# EAGLE design ArduinoBoardPOE (EAGLE 7.4.0)
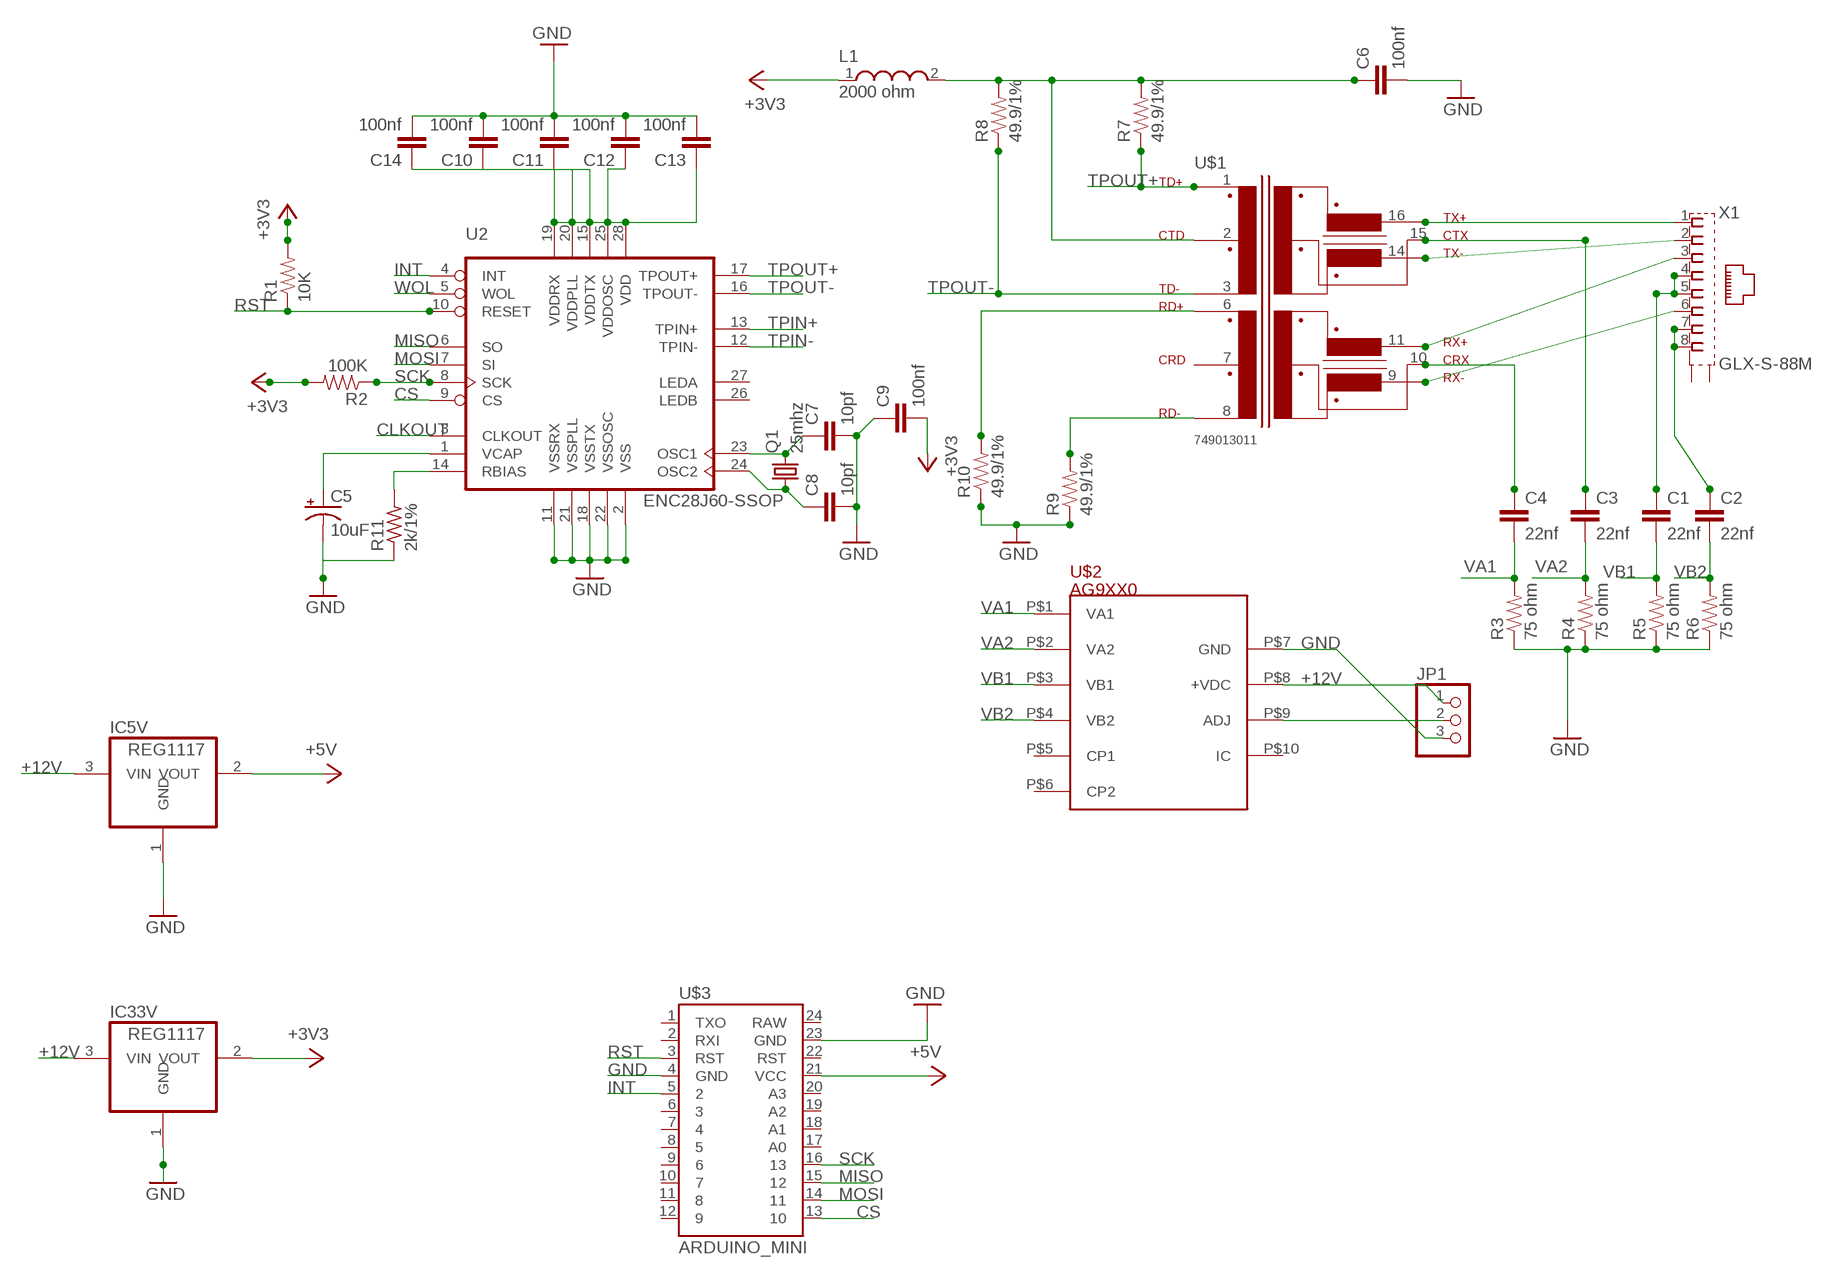
[diagram p0: schematic, sheet 1]

## Parts
C1  22nf  CAP0805  [0805]
C2  22nf  CAP0805  [0805]
C3  22nf  CAP0805  [0805]
C4  22nf  CAP0805  [0805]
C5  10uF  10UF-16V-10%(TANT)  [EIA3216]
C6  100nf  CAP0805  [0805]
C7  10pf  CAP0805  [0805]
C8  10pf  CAP0805  [0805]
C9  100nf  CAP0805  [0805]
C10  100nf  CAP0805  [0805]
C11  100nf  CAP0805  [0805]
C12  100nf  CAP0805  [0805]
C13  100nf  CAP0805  [0805]
C14  100nf  CAP0805  [0805]
IC5V  REG1117  [SOT223]
IC33V  REG1117  [SOT223]
JP1  PINHD-1X3  [1X03]
L1  2000 ohm  WE-CBA_0805(WB/HS)  [WE-CBA_0805(W=3)]
Q1  25mhz  CRYSTALHC49UP  [HC49UP]
R1  10K  RESISTOR0805-RES  [0805]
R2  100K  RESISTOR0805-RES  [0805]
R3  75 ohm  RESISTOR0805-RES  [0805]
R4  75 ohm  RESISTOR0805-RES  [0805]
R5  75 ohm  RESISTOR0805-RES  [0805]
R6  75 ohm  RESISTOR0805-RES  [0805]
R7  49.9/1%  RESISTOR0805-RES  [0805]
R8  49.9/1%  RESISTOR0805-RES  [0805]
R9  49.9/1%  RESISTOR0805-RES  [0805]
R10  49.9/1%  RESISTOR0805-RES  [0805]
R11  2k/1%  R-US_R0805  [R0805]
U2  ENC28J60-SSOP  [SSOP28]
U$1  749013011  [749013011]
U$2  AG9XX0  [AG9000]
U$3  ARDUINO_MINI  [ARDUINO_MINI]
X1  GLX-S-88M  [GLX-S-88M]

## Nets
+3V3: C9.2 IC33V.2(VOUT) L1.1 R1.2 R2.2
+5V: IC5V.2(VOUT) U$3.21(VCC)
+12V: IC5V.3(VIN) IC33V.3(VIN) JP1.1 U$2.P$8(+VDC)
CLKOUT: U2.3(CLKOUT)
CS: U2.9(CS) U$3.13
GND: C5.C(-) C6.2 C7.2 C8.2 C9.1 C10.2 C11.2 C12.2 C13.2 C14.2 IC5V.1(GND) IC33V.1(GND) JP1.3 R3.1 R4.1 R5.1 R6.1 R9.1 R10.1 R11.1 U2.2(VSS) U2.11(VSSRX) U2.18(VSSTX) U2.21(VSSPLL) U2.22(VSSOSC) U$2.P$7(GND) U$3.4(GND) U$3.23(GND)
INT: U2.4(INT) U$3.5
MISO: U2.6(SO) U$3.15
MOSI: U2.7(SI) U$3.14
N$1: U$1.16 X1.1
N$2: U$1.14 X1.2
N$3: U$1.11 X1.3
N$4: U$1.9 X1.6
N$5: C2.1 X1.7 X1.8
N$6: C1.1 X1.4 X1.5
N$7: C3.1 U$1.15
N$8: C4.1 U$1.10
N$9: C6.1 L1.2 R7.2 R8.2 U$1.2
N$10: C7.1 Q1.2 U2.23(OSC1)
N$11: JP1.2 U$2.P$9(ADJ)
N$13: C8.1 Q1.1 U2.24(OSC2)
N$14: C10.1 C11.1 C12.1 C13.1 C14.1 U2.15(VDDTX) U2.19(VDDRX) U2.20(VDDPLL) U2.25(VDDOSC) U2.28(VDD)
N$16: C5.A(+) U2.1(VCAP)
N$17: R11.2 U2.14(RBIAS)
RST: R1.1 U2.10(RESET) U$3.3(RST)
SCK: R2.1 U2.8(SCK) U$3.16
TPIN+: R10.2 U2.13(TPIN+) U$1.6
TPIN-: R9.2 U2.12(TPIN-) U$1.8
TPOUT+: R7.1 U2.17(TPOUT+) U$1.1
TPOUT-: R8.1 U2.16(TPOUT-) U$1.3
VA1: C4.2 R3.2 U$2.P$1(VA1)
VA2: C3.2 R4.2 U$2.P$2(VA2)
VB1: C1.2 R5.2 U$2.P$3(VB1)
VB2: C2.2 R6.2 U$2.P$4(VB2)
WOL: U2.5(WOL)
Unconnected: U2.26(LEDB) U2.27(LEDA) U$1.7 U$2.P$5(CP1) U$2.P$6(CP2) U$2.P$10(IC) U$3.1(TXO) U$3.2(RXI) U$3.6 U$3.7 U$3.8 U$3.9 U$3.10 U$3.11 U$3.12 U$3.17(A0) U$3.18(A1) U$3.19(A2) U$3.20(A3) U$3.22(RST) U$3.24(RAW) X1.S1 X1.S2

## Library data of the parts
C1-C4 C6-C14 = SparkFun-Capacitors:CAP: Capacitor Standard 0603 ceramic capacitor, and 0.1" leaded capacitor.
C5 = SparkFun-Capacitors:10UF-16V-10%(TANT): CAP-00811 1206/EIA-3216 Tantalum capacitor; PROD_ID: CAP-00811
IC5V IC33V = burr-brown:REG1117: 800mA and 1A Low Dropout (LDO) Positive Regulator 1.8V, 2.5V, 2.85V, 3.3V, 5V, and Adj; MPN: REG1117; OC_FARNELL: 1097566; OC_NEWARK: 14P6981
JP1 = Adafruit:PINHD-1X3: PIN HEADER
L1 = SignalCommunications:WE-CBA: WE-CBA SMD EMI Suppression Ferrite Bead Characteristics Reliable Ni-Sn electrodes High rated current up to 5A Recommended soldering: Reflow Operating temperature: -55°C to +125°C Applications * Perfect as data line filter and for uncoupling of distribution voltage *This special SMD chip bead ferrites can be put directly on the printed circuit board. They offer excellent anti-EMI properties and low DC-resistance. Placed very close next to the interference source even with smallest size 0402,maximal impedance at 1000 Ω can be reached. *High Speed: "High Speed " SMD ferrites WE-CBF have lower impedance in the lower frequency ranges thus they have only a low attenuation for fast signals. Application e.g. USB 2.0, IEEE 1394,LVDS *Wide Band: "Wide Band" SMD ferrites WE-CBF already show high impedance in low frequency range. Therefore they are wide band through the whole spectrum. Application e.g. control signats, RS232, RS422, DC/DC converter *High Current: "High Current " SMD ferrites WE-CBF are designed for high current (over 1 A). The rated current refers to 40K self-heating. High current SMD ferrites are available in all there types (High Speed, Wide Band and High Frequency). Application e.g. power supply, DC/DC converter *Advice: Pay attention for the use of SMD-Ferrites for high current>1A and ambient temperature over +85°C that the rated current has to be reduced when temperature is above +85°C (Derating). *At+100°C environment temperature the maximal rated current has to add up to only 60% of the data sheet value ,without an overload of the component. Variant abbreviation WB means WIDE BAND HS means HIGH SPEED HC means HIGH CURRENT <http://katalog.we-online.de/media/images/eisos/FeCBA_pf2.jpg> Details see: http://katalog.we-online.de/en/pbs/WE-CBA/ Created: 2015-02-02 2015 (C) Wurth Elektronik
Q1 = Adafruit:CRYSTAL: CRYSTAL; OC_FARNELL: unknown; OC_NEWARK: unknown
R1-R10 = SparkFun-Resistors:RESISTOR: Resistor Basic schematic elements and footprints for 0603, 1206, and PTH resistors.
R11 = Adafruit:R-US_: RESISTOR, American symbol
U2 = microchip-enc28j60:ENC28J60-*: Microchip 10Mbit Eth. contoller with SPI interface
U$1 = Wurth_Electronics_Midcom_Speedy_and_standard_magnetics:749013011: Package Style: 10/100, 1 Port, ETR, PoE Mounting: SMD Pins: 16 pins Header: 250-0512 Best pinouts for production vary per application. Please contact Wurth Electronics Midcom, Inc. for assistance with your custom design. Datasheet: 749013011 <http://katalog.we-online.de/kataloge/eisos/media/pdf/749013011.pdf> Website: Wurth Electronics Midcom <http://www.we-online.com/midcom> Contact us Wurth Electronics Midcom, Inc. 121 Airport Dr. Watertown, SD 57201 Phone: (605) 886-4385 Fax: (605) 886-4486 E-Mail: midcom@we-online.com
U$2 = SmartPrj:AG9XX0: PoE module
U$3 = SparkFun-Boards:ARDUINO_MINI: Arduino Pro Mini footprint
X1 = con-kycon:GLX-S-88M: Mod. Jack, Right Angle, 8 posiotion, 8 contatcs RJ45 Source: GLX-S-88M.pdf; OC_FARNELL: unknown; OC_NEWARK: unknown

## Board
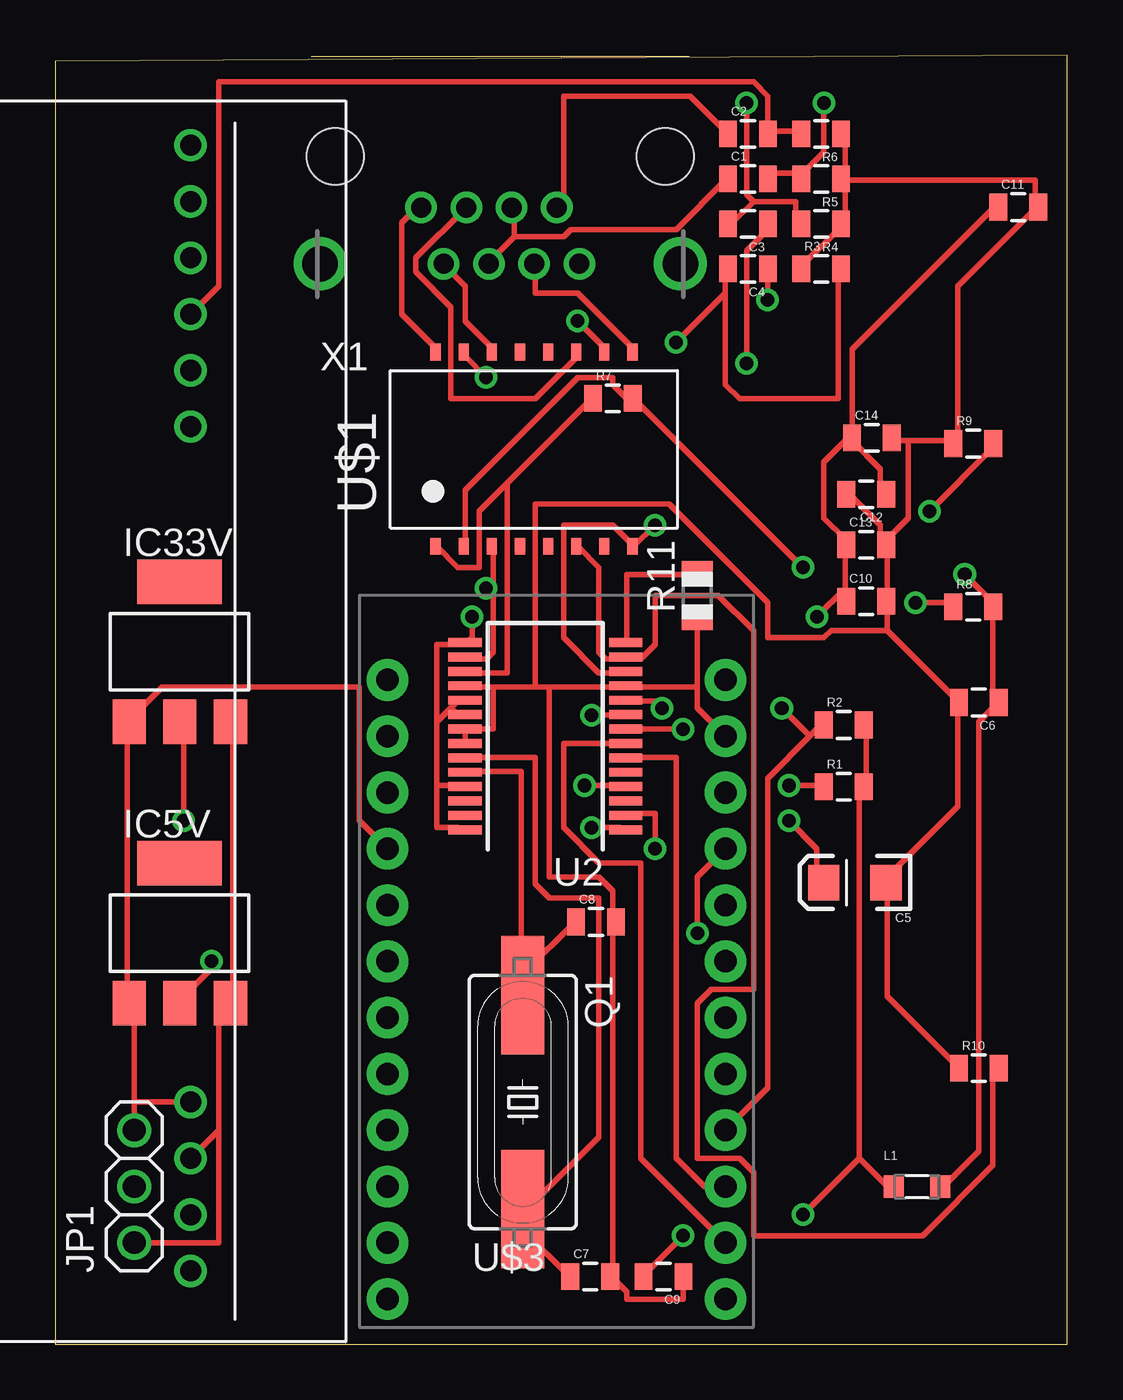
[diagram p1: board, top side]
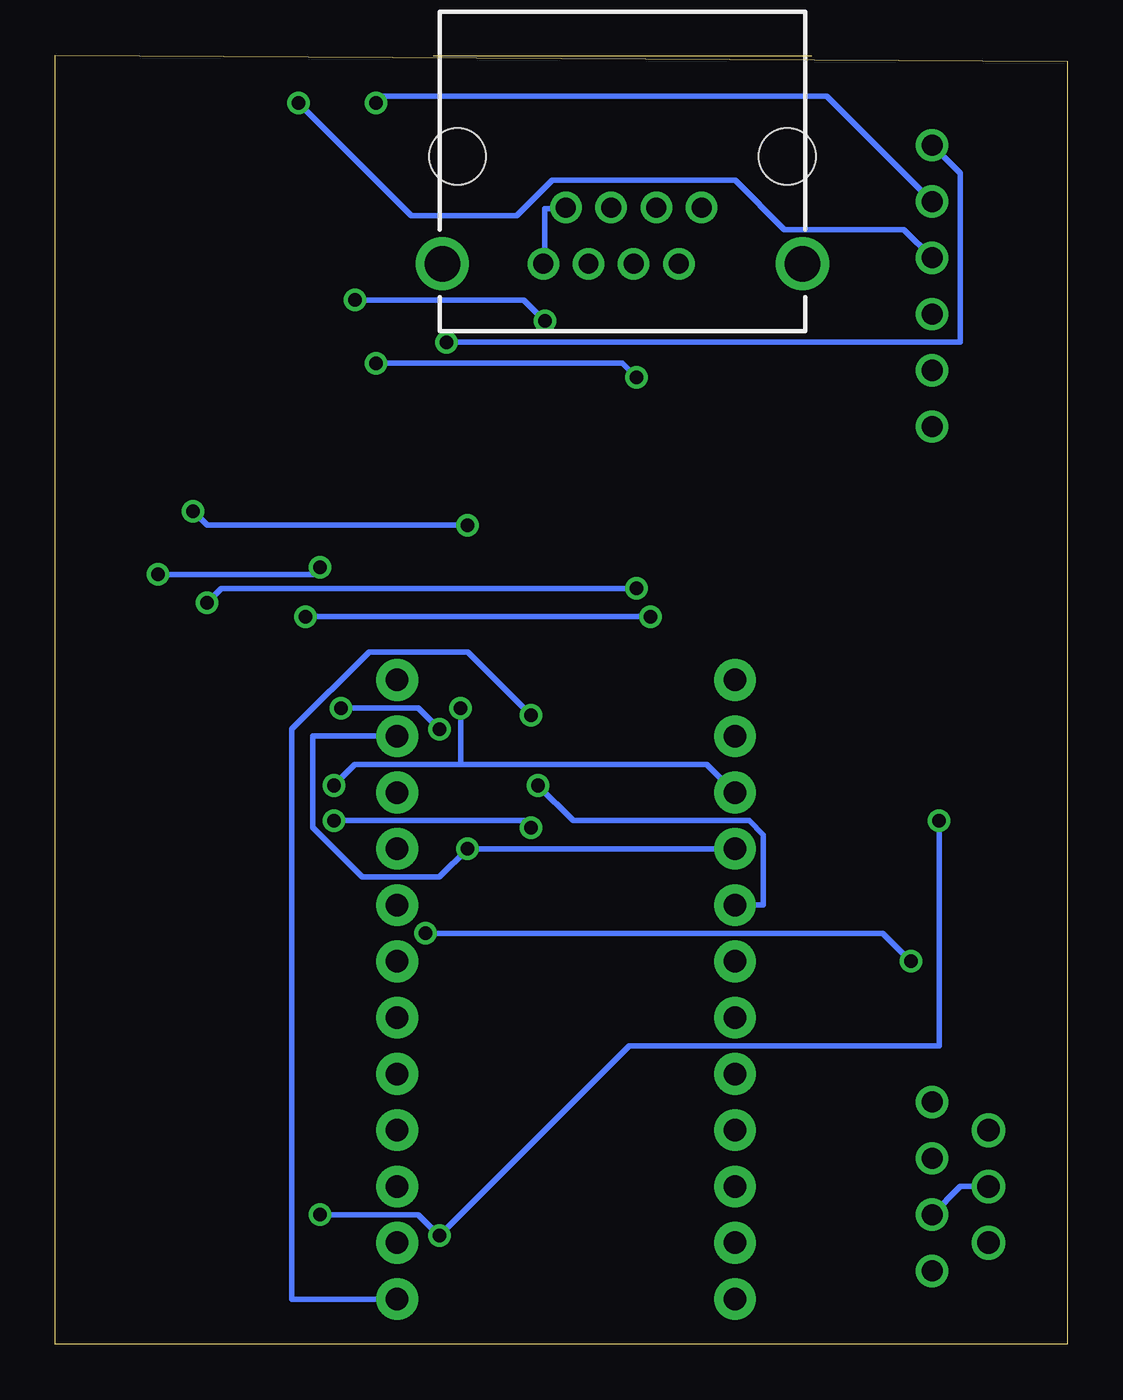
[diagram p2: board, bottom side, seen from below]

Size 45.64 x 58.16 mm. Coordinates in mm from the lower left corner, seen from the top.
Outline: 0,0 45.64,0 45.64,58.16 0,57.9 0,0
Copper layers (1*16): Top 0.035mm / dielectric 1.5mm / Bottom 0.035mm
Design rules "default": minimum track width 10mil, minimum drill 24mil, track to track 8mil, track to pad 8mil, pad to pad 8mil, via to via 8mil, smd to smd 8mil, copper to edge 40mil, drill to drill 8mil, minimum pad ring 10mil, minimum via ring 8mil, stop-mask expansion 4mil, vias tented up to drill 0mil, thermal gap 10mil

### Footprints (pad centres in the part's own frame; a part is rotated, then mirrored left to right if it is on the bottom)
0805 = smd 0.8 x 1.2: 1 -0.9,0; 2 0.9,0
EIA3216 = smd 1.4 x 1.6: A 1.4,0; C -1.4,0
SOT223 = smd 1.499 x 2.007: 1 -2.261,-3.15; 2 0.025,-3.15; 3 2.311,-3.15 | smd 3.81 x 2.007: 4 0,3.15
1X03 = drill 1.016: 1 -2.54,0; 2 0,0; 3 2.54,0
WE-CBA_0805(W=3) = smd 0.9 x 1: 1 -1.05,0; 2 1.05,0
HC49UP = smd 5.334 x 1.93: 1 -4.826,0; 2 4.826,0
R0805 = smd 1.1 x 1.4: 1 -1,0; 2 1,0
SSOP28 = smd 0.4 x 1.5: 1 -4.225,-3.625; 2 -3.575,-3.625; 3 -2.925,-3.625; 4 -2.275,-3.625; 5 -1.625,-3.625; 6 -0.975,-3.625; 7 -0.325,-3.625; 8 0.325,-3.625; 9 0.975,-3.625; 10 1.625,-3.625; 11 2.275,-3.625; 12 2.925,-3.625; 13 3.575,-3.625; 14 4.225,-3.625; 15 4.225,3.625; 16 3.575,3.625; 17 2.925,3.625; 18 2.275,3.625; 19 1.625,3.625; 20 0.975,3.625; 21 0.325,3.625; 22 -0.325,3.625; 23 -0.975,3.625; 24 -1.625,3.625; 25 -2.275,3.625; 26 -2.925,3.625; 27 -3.575,3.625; 28 -4.225,3.625
749013011 = smd 0.762 x 0.457: 1 -4.381,4.445; 2 -4.381,3.175; 3 -4.381,1.905; 4 -4.381,0.635; 5 -4.381,-0.635; 6 -4.381,-1.905; 7 -4.381,-3.175; 8 -4.381,-4.445; 9 4.381,-4.445; 10 4.381,-3.175; 11 4.381,-1.905; 12 4.381,-0.635; 13 4.381,0.635; 14 4.381,1.905; 15 4.381,3.175; 16 4.381,4.445
AG9000 = drill 0.95 pad 1.422: P$1 0,0; P$2 2.54,0; P$3 5.08,0; P$4 7.62,0; P$5 10.16,0; P$6 12.7,0; P$7 43.18,0; P$8 45.72,0; P$9 48.26,0; P$10 50.8,0
ARDUINO_MINI = drill 1.016 pad 1.88: 1 -7.62,12.7; 2 -7.62,10.16; 3 -7.62,7.62; 4 -7.62,5.08; 5 -7.62,2.54; 6 -7.62,0; 7 -7.62,-2.54; 8 -7.62,-5.08; 9 -7.62,-7.62; 10 -7.62,-10.16; 11 -7.62,-12.7; 12 -7.62,-15.24; 13 7.62,-15.24; 14 7.62,-12.7; 15 7.62,-10.16; 16 7.62,-7.62; 17 7.62,-5.08; 18 7.62,-2.54; 19 7.62,0; 20 7.62,2.54; 21 7.62,5.08; 22 7.62,7.62; 23 7.62,10.16; 24 7.62,12.7
GLX-S-88M = drill 0.9 pad 1.422: 1 -3.57,-2.3; 2 -2.55,-4.84; 3 -1.53,-2.3; 4 -0.51,-4.84; 5 0.51,-2.3; 6 1.53,-4.84; 7 2.55,-2.3; 8 3.57,-4.84 | drill 1.6 pad 2.184: S1 -8.125,-4.84; S2 8.125,-4.84 | hole 2.55: -7.44,0; 7.44,0

### Placement (x,y rotation side)
C1  31.24,52.58 0 top
C2  31.24,54.61 0 top
C3  31.24,50.55 180 top
C4  31.24,48.51 180 top
C5  36.07,20.83 180 top
C6  41.66,28.96 180 top
C7  24.13,3.05 0 top
C8  24.38,19.05 0 top
C9  27.43,3.05 180 top
C10  36.58,33.53 0 top
C11  43.43,51.31 0 top
C12  36.58,38.35 180 top
C13  36.58,36.07 0 top
C14  36.83,40.89 0 top
IC5V  5.59,18.54 0 top
IC33V  5.59,31.24 0 top
JP1  3.56,7.11 90 top
L1  38.86,7.11 0 top
Q1  21.08,10.92 270 top
R1  35.56,25.15 0 top
R2  35.56,27.94 0 top
R3  34.54,48.51 0 top
R4  34.54,50.55 180 top
R5  34.54,52.58 180 top
R6  34.54,54.61 180 top
R7  25.15,42.67 0 top
R8  41.4,33.27 0 top
R9  41.4,40.64 0 top
R10  41.66,12.45 0 top
R11  28.96,33.78 90 top
U2  22.1,27.43 90 top
U$1  21.59,40.39 90 top
U$2  6.1,54.1 270 top
U$3  22.61,17.27 0 top
X1  20.07,53.59 0 top

### Tracks (layer width: path | path; a pad name or v marks a point on that pad's centre or on a via)
+3V3  (via drill 0.61)
  Top 0.254: 36.26,8.38 37.53,7.11 L1.1 | 36.26,8.38 36.26,24.89 R1.2 36.58,25.21 36.58,27.75 R2.2 | v28.32,4.89 26.73,3.3 C9.2 | 36.26,8.38 v33.72,5.84 | v5.78,23.62 5.78,28.07 IC33V.2
  Bottom 0.254: v33.72,5.84 29.27,5.84 v28.32,4.89 19.75,13.46 5.78,13.46 v5.78,23.62
+5V  (via drill 0.61)
  Top 0.254: v7.05,17.27 7.05,16.95 5.78,15.68 IC5V.2 | v28.96,18.54 28.96,21.08 U$3.21
  Bottom 0.254: v7.05,17.27 8.32,18.54 v28.96,18.54
+12V
  Top 0.254: 7.37,9.65 7.37,15.05 7.68,15.37 IC5V.3 8,15.68 8,28.07 IC33V.3 | U$2.P$8 7.37,9.65 | JP1.1 7.37,4.57 7.37,9.65
CS  (via drill 0.61)
  Top 0.254: v24.19,28.38 25.46,28.38 U2.9
  Bottom 0.254: v24.19,28.38 27.05,31.24 31.5,31.24 34.99,27.75 34.99,2.03 U$3.13
GND  (via drill 0.61)
  Top 0.254: R6.1 35.62,54.42 35.62,52.83 R5.1 35.62,52.51 | R3.1 33.72,48.7 35.31,50.29 R4.1 35.62,50.61 35.62,52.51 | 38.48,40.77 37.85,40.77 C14.2 | 38.48,40.77 40.39,40.77 R9.1 40.7,40.77 40.7,47.75 44.2,51.24 C11.2 44.2,51.56 44.2,52.51 35.62,52.51 | R10.1 40.7,12.51 37.53,15.68 37.53,20.77 C5.C 37.53,21.08 40.7,24.26 40.7,28.7 C6.2 40.7,29.02 37.53,32.2 | C13.2 37.53,36 37.53,33.78 C10.2 37.53,33.47 37.53,32.2 | C12.2 35.94,38.23 37.21,36.96 37.21,36.32 C13.2 | 38.48,40.77 38.48,37.27 37.53,36.32 C13.2 | JP1.3 3.56,10.92 | 3.56,10.92 3.56,15.37 IC5V.1 3.24,15.68 3.24,28.07 IC33V.1 3.56,28.38 4.83,29.65 13.72,29.65 13.72,23.62 U$3.4 | 3.56,10.92 U$2.P$7 | C9.1 28.32,2.98 28.32,2.03 25.78,2.03 25.78,2.35 25.15,2.98 C7.2 25.15,3.3 25.15,18.86 C8.2 25.15,19.18 25.15,20.45 24.51,21.08 22.29,21.08 22.29,29.65 | v27.05,22.35 27.05,23.94 25.78,23.94 U2.2 | 18.48,27.75 U2.22 | 22.29,29.65 25.46,29.65 U2.11 25.78,29.65 28.96,29.65 | 22.29,29.65 21.65,29.65 | 21.65,29.65 19.75,29.65 | 19.75,29.65 18.48,29.65 U2.18 | 18.48,27.75 19.75,27.75 19.75,29.65 | 18.48,27.75 U2.21 | 28.96,29.65 28.96,28.7 U$3.23 | 28.96,29.65 R11.1 | 37.53,32.2 34.99,32.2 34.67,31.88 32.13,31.88 32.13,33.47 27.69,37.91 21.65,37.91 21.65,29.65
  Bottom 0.254: U$3.4 v27.05,22.35 28.32,21.08 31.81,21.08 34.04,23.3 34.04,27.43 U$3.23
INT  (via drill 0.61)
  Top 0.254: v23.88,25.21 25.46,25.21 U2.4
  Bottom 0.254: v23.88,25.21 22.29,23.62 14.35,23.62 13.72,22.99 13.72,19.81 U$3.5
MISO
  Top 0.254: U$3.15 29.27,7.11 28,8.38 28,26.48 25.78,26.48 U2.6
MOSI
  Top 0.254: U$3.14 26.42,8.38 26.42,21.72 24.51,21.72 22.92,23.3 22.92,27.11 25.46,27.11 U2.7
N$1
  Top 0.254: U$1.16 17.21,44.9 15.62,46.48 15.62,50.61 16.26,51.24 X1.1
N$2
  Top 0.254: U$1.14 19.75,44.9 18.48,46.16 18.48,47.75 17.53,48.7 X1.2
N$3
  Top 0.254: U$1.11 23.56,44.58 21.65,42.67 17.84,42.67 17.84,46.8 16.26,48.39 16.26,49.02 18.48,51.24 X1.3
N$4
  Top 0.254: U$1.9 26.1,44.9 23.56,47.43 21.65,47.43 21.65,48.7 X1.6
N$5
  Top 0.254: C2.1 30.23,54.74 28.64,56.32 22.92,56.32 22.92,51.56 X1.7
  Bottom 0.254: X1.8 23.56,49.02 23.56,51.24 22.92,51.24 X1.7
N$6
  Top 0.254: 20.7,49.97 22.92,49.97 23.24,50.29 28,50.29 30.23,52.51 C1.1 | 20.7,49.97 20.7,51.24 X1.5 | 20.7,49.97 19.75,49.02 X1.4
N$7  (via drill 0.61)
  Top 0.254: v19.43,43.62 18.48,44.58 U$1.15 | v31.18,44.26 31.18,49.34 32.13,50.29 C3.1
  Bottom 0.254: v19.43,43.62 20.07,44.26 v31.18,44.26
N$8  (via drill 0.61)
  Top 0.254: v23.56,46.16 24.83,44.9 U$1.10 | v32.13,47.12 32.13,48.39 C4.1
  Bottom 0.254: v23.56,46.16 24.51,47.12 v32.13,47.12
N$9  (via drill 0.61)
  Top 0.254: U$1.2 18.48,36 18.48,38.54 23.56,43.62 25.15,43.62 25.15,43.31 25.78,42.67 R7.2 26.1,42.67 v33.72,35.05 | L1.2 40.07,7.11 41.66,8.7 41.66,28.07 42.29,28.7 C6.1 42.29,29.02 42.29,33.15 R8.2 42.29,33.47 v41.02,34.73
  Bottom 0.254: v33.72,35.05 34.04,34.73 v41.02,34.73
N$10
  Top 0.254: C7.1 22.92,3.3 21.34,4.89 21.34,5.84 Q1.2 21.34,6.16 24.51,9.33 24.51,20.13 22.29,20.13 21.65,20.77 21.65,26.48 18.48,26.48 U2.23
N$11
  Bottom 0.254: U$2.P$9 4.83,7.11 JP1.2
N$13
  Top 0.254: C8.1 23.24,18.86 21.34,16.95 21.34,16 Q1.1 21.02,16 21.02,25.84 18.48,25.84 U2.24
N$14  (via drill 0.61)
  Top 0.254: 17.21,28.07 17.21,25.21 | 17.21,25.21 17.21,23.3 18.16,23.3 U2.28 | 17.84,28.7 18.16,29.02 U2.19 | 17.84,28.7 17.21,28.07 | 17.21,25.21 18.16,25.21 U2.25 | 17.84,28.7 18.16,28.38 U2.20 | 17.21,28.07 17.21,31.56 18.16,31.56 U2.15 18.48,31.56 18.8,31.88 v18.8,32.83 | 35.62,34.1 35.62,36 C13.1 35.62,36.32 34.67,37.27 34.67,39.81 35.62,40.77 C14.1 | 35.62,34.1 35.62,33.78 C10.1 35.62,34.1 | C14.1 35.94,40.77 37.21,39.5 37.21,38.54 C12.1 | C11.1 42.29,51.24 35.94,44.9 35.94,41.08 C14.1 | 35.62,34.1 v34.35,32.83
  Bottom 0.254: v34.35,32.83 v18.8,32.83
N$16  (via drill 0.61)
  Top 0.254: v24.19,23.3 25.46,23.3 U2.1 | v33.08,23.62 34.35,22.35 34.35,21.08 C5.A
  Bottom 0.254: v24.19,23.3 24.51,23.62 v33.08,23.62
N$17
  Top 0.254: R11.2 28.96,34.73 25.78,34.73 25.78,31.56 U2.14
RST  (via drill 0.61)
  Top 0.254: v33.08,25.21 34.35,25.21 R1.1 | v27.37,28.7 27.37,29.02 25.78,29.02 U2.10
  Bottom 0.254: v33.08,25.21 32.13,26.16 27.37,26.16 | 27.37,26.16 16.26,26.16 U$3.3 | 27.37,26.16 v27.37,28.7
SCK  (via drill 0.61)
  Top 0.254: 34.04,27.43 32.13,25.53 32.13,11.56 U$3.16 | 34.04,27.43 34.35,27.75 R2.1 | v28.32,27.75 25.78,27.75 U2.8 | 34.04,27.43 v32.77,28.7
  Bottom 0.254: v28.32,27.75 29.27,28.7 v32.77,28.7
TPIN+
  Top 0.254: U$1.6 23.56,36 24.51,35.05 24.51,31.24 24.83,30.93 25.46,30.93 U2.13 25.78,30.93 26.42,30.93 27.05,31.56 27.05,33.78 29.91,33.78 31.5,32.2 31.5,16 29.59,16 28.96,15.37 28.96,8.38 30.86,8.38 31.5,7.75 31.5,4.89 39.12,4.89 42.29,8.06 42.29,12.19 R10.2
TPIN-  (via drill 0.61)
  Top 0.254: 26.1,36 25.15,36.96 22.92,36.96 22.92,31.88 24.51,30.29 25.46,30.29 U2.12 | v39.43,37.59 42.29,40.45 R9.2 | 26.1,36 v27.05,36.96 | 26.1,36 U$1.8
  Bottom 0.254: v39.43,37.59 38.8,36.96 v27.05,36.96
TPOUT+
  Top 0.254: 20.38,38.86 24.19,42.67 R7.1 | 20.38,38.86 19.11,37.59 19.11,35.05 18.16,35.05 17.21,36 U$1.1 | 20.38,38.86 20.38,30.29 18.48,30.29 U2.17
TPOUT-  (via drill 0.61)
  Top 0.254: 19.75,34.1 19.75,31.24 19.43,30.93 18.48,30.93 U2.16 | 19.75,34.1 19.75,36 U$1.3 | v38.8,33.47 40.39,33.47 R8.1 | 19.75,34.1 v19.43,34.1
  Bottom 0.254: v38.8,33.47 38.16,34.1 v19.43,34.1
VA1  (via drill 0.61)
  Top 0.254: 30.23,47.43 30.23,43.31 30.86,42.67 35.31,42.67 35.31,48.39 R3.2 | 30.23,47.43 30.23,48.39 C4.2 | 30.23,47.43 v28,45.21
  Bottom 0.254: U$2.P$1 4.83,52.83 4.83,45.21 v28,45.21
VA2  (via drill 0.61)
  Top 0.254: 31.5,51.56 30.54,50.61 C3.2 | 31.5,51.56 33.4,51.56 33.4,50.61 R4.2 | 31.5,51.56 31.18,51.88 v31.18,56.01
  Bottom 0.254: v31.18,56.01 30.86,56.32 10.86,56.32 U$2.P$2
VB1  (via drill 0.61)
  Top 0.254: C1.2 32.45,52.83 33.4,52.83 R5.2 33.72,52.83 34.67,53.79 v34.67,56.01
  Bottom 0.254: v34.67,56.01 29.59,50.93 24.83,50.93 23.24,52.51 14.99,52.51 12.76,50.29 7.37,50.29 U$2.P$3
VB2
  Top 0.254: R6.2 33.4,54.74 32.45,54.74 C2.2 32.13,54.74 32.13,56.32 31.5,56.96 7.37,56.96 7.37,47.75 U$2.P$4
(copper drawn outside any net)
  shapes: Bottom area x1